# EAGLE design as3320-Bandpass (EAGLE 9.6.2)

## Sheet 1 of 6
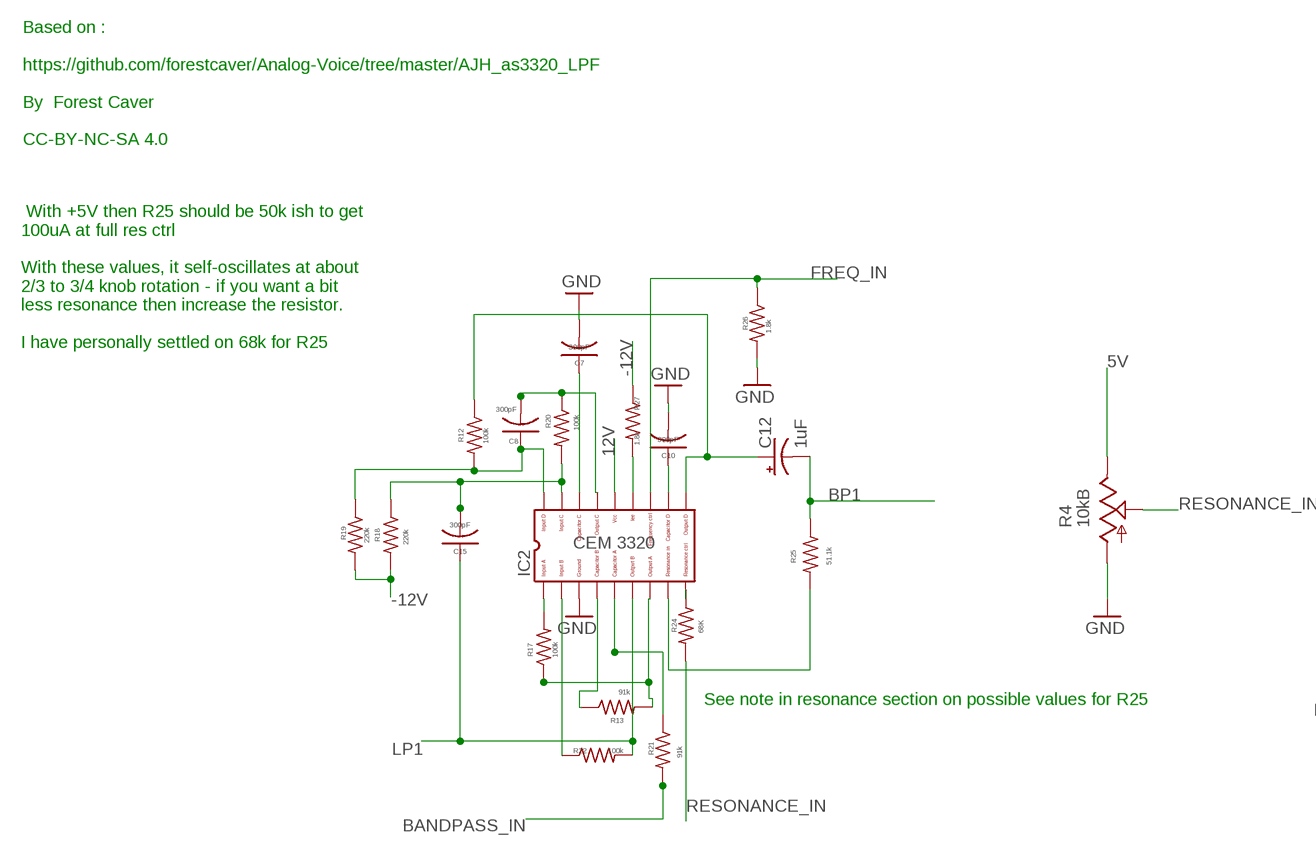
[diagram p0: schematic, sheet 1, part 1 of 2]
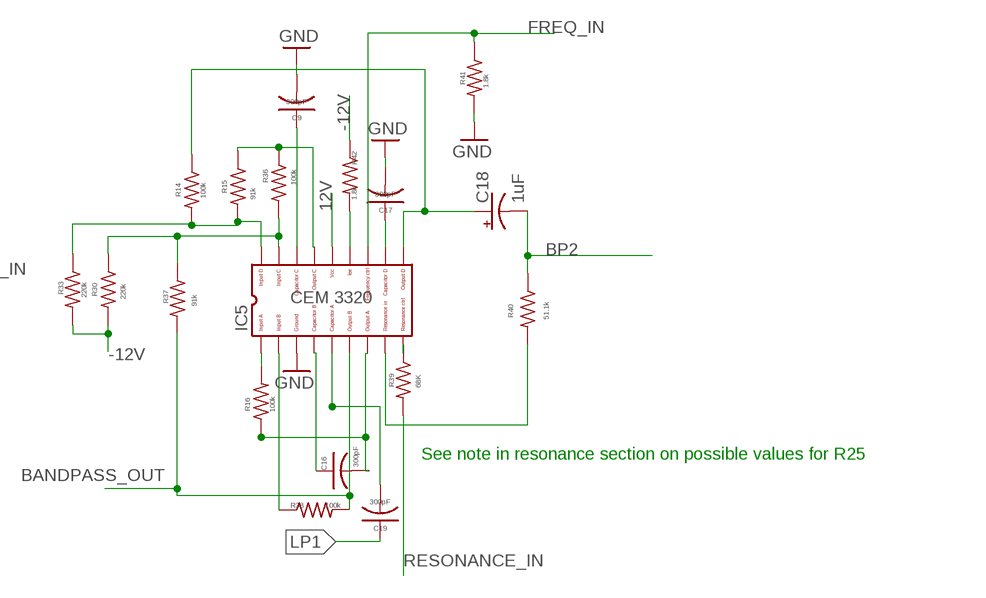
[diagram p1: schematic, sheet 1, part 2 of 2]

### Parts
C7  300pF  C-USC0603  [C0603]
C8  300pF  C-USC0603  [C0603]
C9  300pF  C-USC0603  [C0603]
C10  300pF  C-USC0603  [C0603]
C12  1uF  CPOL-USB  [PANASONIC_B]
C15  300pF  C-USC0603  [C0603]
C16  300pF  C-USC0603  [C0603]
C17  300pF  C-USC0603  [C0603]
C18  1uF  CPOL-USB  [PANASONIC_B]
C19  300pF  C-USC0603  [C0603]
IC2  CEM3320  [DIL18]
IC5  CEM3320  [DIL18]
R4  10kB  POT_USVERTICAL  [ALPS_POT_VERTICAL]
R12  100k  R-US_R0603  [R0603]
R13  91k  R-US_R0603  [R0603]
R14  100k  R-US_R0603  [R0603]
R15  91k  R-US_R0603  [R0603]
R16  100k  R-US_R0603  [R0603]
R17  100k  R-US_R0603  [R0603]
R18  220k  R-US_R0603  [R0603]
R19  220k  R-US_R0603  [R0603]
R20  100k  R-US_R0603  [R0603]
R21  91k  R-US_R0603  [R0603]
R22  100k  R-US_R0603  [R0603]
R24  68K  R-US_R0603  [R0603]
R25  51.1k  R-US_R0603  [R0603]
R26  1.8k  R-US_R0603  [R0603]
R27  1.8k  R-US_R0603  [R0603]
R30  220k  R-US_R0603  [R0603]
R33  220k  R-US_R0603  [R0603]
R36  100k  R-US_R0603  [R0603]
R37  91k  R-US_R0603  [R0603]
R38  100k  R-US_R0603  [R0603]
R39  68K  R-US_R0603  [R0603]
R40  51.1k  R-US_R0603  [R0603]
R41  1.8k  R-US_R0603  [R0603]
R42  1.8k  R-US_R0603  [R0603]

### Nets
5V [power]: R4.P$1(E) ; also sheet 4
12V [power]: IC2.14 IC5.14 ; also sheet 2,3,6
-12V [power]: R18.2 R19.2 R27.1 R30.2 R33.2 R42.1 ; also sheet 2,3,6
BANDPASS_IN: R21.2 ; also sheet 3
BANDPASS_OUT: IC5.6 R37.2 R38.2 ; also sheet 6
BP1: C12.- R25.1
BP2: C18.- R40.1
FREQ_IN: IC2.12 IC5.12 R26.1 R41.1 ; also sheet 3
GND [power]: C7.2 C9.2 C10.2 C17.2 IC2.3 IC5.3 R4.P$3(A) R26.2 R41.2 ; also sheet 2,3,4,6
LP1: C15.1 C19.1 IC2.6 R22.2
N$2 [nearfilter]: C10.1 IC2.11
N$14 [nearfilter]: IC2.9 R24.1
N$16 [nearfilter]: IC2.8 R25.2
N$17 [nearfilter]: IC2.13 R27.2
N$18 [nearfilter]: C17.1 IC5.11
N$19: C7.1 IC2.16
N$21 [nearfilter]: IC5.9 R39.1
N$23 [nearfilter]: C12.+ IC2.10 R12.1
N$24: IC2.5 R21.1
N$25: IC2.7 R13.2 R17.1
N$26: IC2.4 R13.1
N$27: IC2.2 R22.1
N$28 [nearfilter]: IC5.8 R40.2
N$29 [nearfilter]: IC5.13 R42.2
N$30: C9.1 IC5.16
N$31 [nearfilter]: C18.+ IC5.10 R14.1
N$32: C19.2 IC5.5
N$33: C16.2 IC5.7 R16.1
N$34: C16.1 IC5.4
N$35: IC5.2 R38.1
N$37: IC5.1 R16.2
N$38: IC5.17 R30.1 R36.2 R37.1
N$41: IC5.15 R15.1 R36.1
N$42: IC5.18 R14.2 R15.2 R33.1
N$43: IC2.1 R17.2
N$44: C15.2 IC2.17 R18.1 R20.2
N$49: C8.2 IC2.15 R20.1
N$50: C8.1 IC2.18 R12.2 R19.1
RESONANCE_IN: R4.P$2(S) R24.2 R39.2

### Notes on the sheet
- Based on :
  
  https://github.com/forestcaver/Analog-Voice/tree/master/AJH_as3320_LPF
  
  By  Forest Caver
  
  CC-BY-NC-SA 4.0
- With +5V then R25 should be 50k ish to get
  100uA at full res ctrl
  
  With these values, it self-oscillates at about
  2/3 to 3/4 knob rotation - if you want a bit
  less resonance then increase the resistor.
  
  I have personally settled on 68k for R25
- See note in resonance section on possible values for R25
- See note in resonance section on possible values for R25

## Sheet 2 of 6
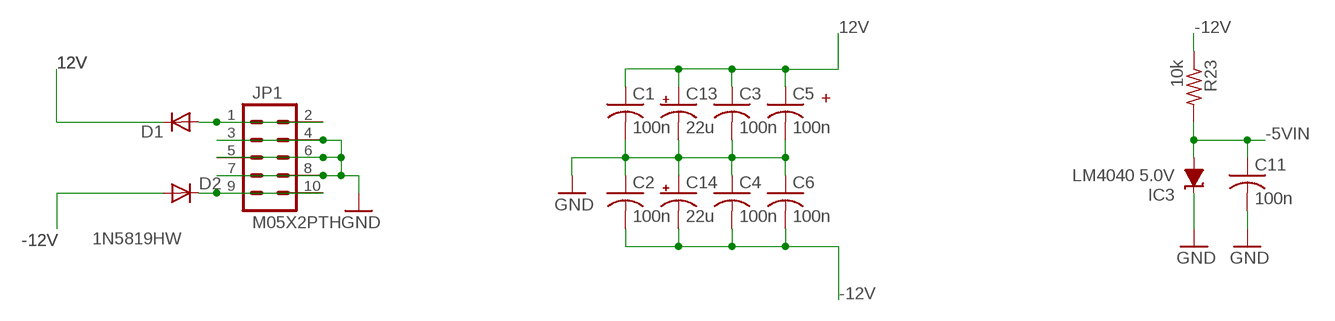
[diagram p2: schematic, sheet 2]

### Parts
C1  100n  C-USC0603  [C0603]
C2  100n  C-USC0603  [C0603]
C3  100n  C-USC0603  [C0603]
C4  100n  C-USC0603  [C0603]
C5  100n  C-USC0603  [C0603]
C6  100n  C-USC0603  [C0603]
C11  100n  C-USC0603  [C0603]
C13  22u  CPOL-USB  [PANASONIC_B]
C14  22u  CPOL-USB  [PANASONIC_B]
D1  1N5819HW  DIODE-SOD123  [SOD123]
D2  1N5819HW  DIODE-SOD123  [SOD123]
IC3  LM4040 5.0V  LM4041C12DBZ  [DBZ_R-PDSO-G3]
JP1  M05X2PTH  [AVR_ICSP]
R23  10k  R-US_R0603  [R0603]

### Nets
12V [power]: C1.1 C3.1 C5.1 C13.+ D1.C ; also sheet 1,3,6
-5VIN [power]: C11.1 IC3.2(A) R23.2 ; also sheet 4
-12V [power]: C2.2 C4.2 C6.2 C14.- D2.A R23.1 ; also sheet 1,3,6
GND [power]: C1.2 C2.1 C3.2 C4.1 C5.2 C6.1 C11.2 C13.- C14.+ IC3.1(C) JP1.3 JP1.4 JP1.5 JP1.6 JP1.7 JP1.8 ; also sheet 1,3,4,6
N$6: D1.A JP1.1 JP1.2
N$20: D2.C JP1.9 JP1.10

### Notes on the sheet
- +

## Sheet 3 of 6
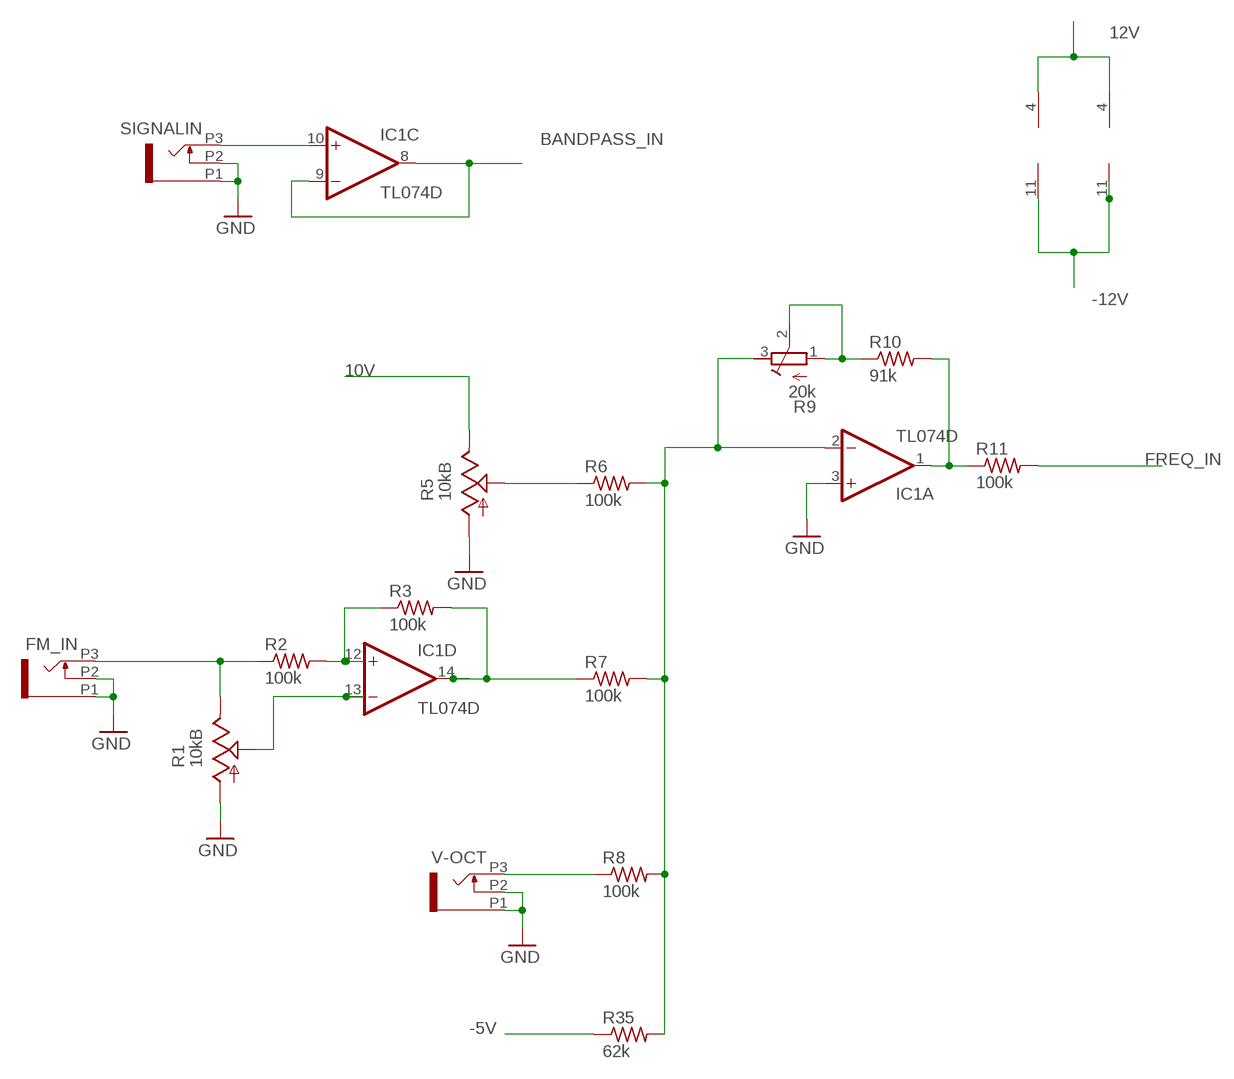
[diagram p3: schematic, sheet 3]

### Parts
FM_IN  PJ301_THONKICONN6  [WQP_PJ_301M6]
IC1  TL074D  [SO14]
IC4  TL074D  [SO14]
R1  10kB  POT_USVERTICAL  [ALPS_POT_VERTICAL]
R2  100k  R-US_R0603  [R0603]
R3  100k  R-US_R0603  [R0603]
R5  10kB  POT_USVERTICAL  [ALPS_POT_VERTICAL]
R6  100k  R-US_R0603  [R0603]
R7  100k  R-US_R0603  [R0603]
R8  100k  R-US_R0603  [R0603]
R9  20k  R-TRIMM3296X  [RTRIM3296X]
R10  91k  R-US_R0603  [R0603]
R11  100k  R-US_R0603  [R0603]
R35  62k  R-US_R0603  [R0603]
SIGNALIN  PJ301_THONKICONN6  [WQP_PJ_301M6]
V-OCT  PJ301_THONKICONN6  [WQP_PJ_301M6]

### Nets
10V [power]: R5.P$1(E) ; also sheet 4
12V [power]: IC1.4(P:V+) IC4.4(P:V+) ; also sheet 1,2,6
-5V [power]: R35.1 ; also sheet 4
-12V [power]: IC1.11(P:V-) IC4.11(P:V-) ; also sheet 1,2,6
BANDPASS_IN: IC1.8(C:OUT) IC1.9(C:-IN) ; also sheet 1
FREQ_IN: R11.2 ; also sheet 1
GND [power]: FM_IN.P1 FM_IN.P2 IC1.3(A:+IN) R1.P$3(A) R5.P$3(A) SIGNALIN.P1 SIGNALIN.P2 V-OCT.P1 V-OCT.P2 ; also sheet 1,2,4,6
N$3: IC1.13(D:-IN) R1.P$2(S)
N$4: R5.P$2(S) R6.1
N$5: IC1.12(D:+IN) R2.2 R3.1
N$7: IC1.2(A:-IN) R6.2 R7.2 R8.2 R9.3(A) R35.2
N$8: IC1.1(A:OUT) R10.2 R11.1
N$9: IC1.10(C:+IN) SIGNALIN.P3
N$10: R8.1 V-OCT.P3
N$12: IC1.14(D:OUT) R3.2 R7.1
N$55: R9.1(E) R9.2(S) R10.1
N$82: FM_IN.P3 R1.P$1(E) R2.1
Unconnected: IC1.5(B:+IN) IC1.6(B:-IN) IC1.7(B:OUT) IC4.12(D:+IN) IC4.13(D:-IN) IC4.14(D:OUT)

## Sheet 4 of 6: Ref
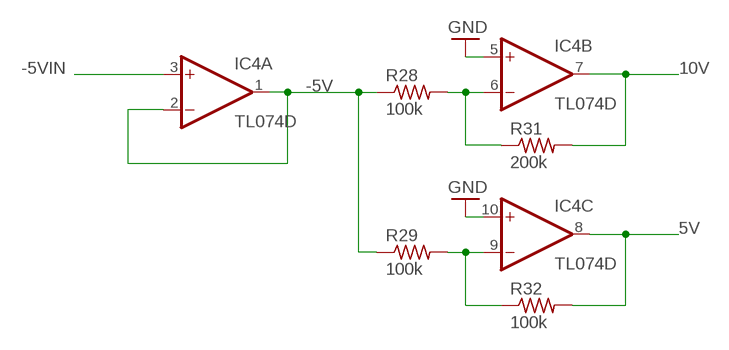
[diagram p4: schematic, sheet 4]

### Parts
R28  100k  R-US_R0603  [R0603]
R29  100k  R-US_R0603  [R0603]
R31  200k  R-US_R0603  [R0603]
R32  100k  R-US_R0603  [R0603]

### Nets
5V [power]: IC4.8(C:OUT) R32.2 ; also sheet 1
10V [power]: IC4.7(B:OUT) R31.2 ; also sheet 3
-5V [power]: IC4.1(A:OUT) IC4.2(A:-IN) R28.1 R29.1 ; also sheet 3
-5VIN [power]: IC4.3(A:+IN) ; also sheet 2
GND [power]: IC4.5(B:+IN) IC4.10(C:+IN) ; also sheet 1,2,3,6
N$13: IC4.9(C:-IN) R29.2 R32.1
N$15: IC4.6(B:-IN) R28.2 R31.1

## Sheet 5 of 6: Summing

## Sheet 6 of 6: Outputs
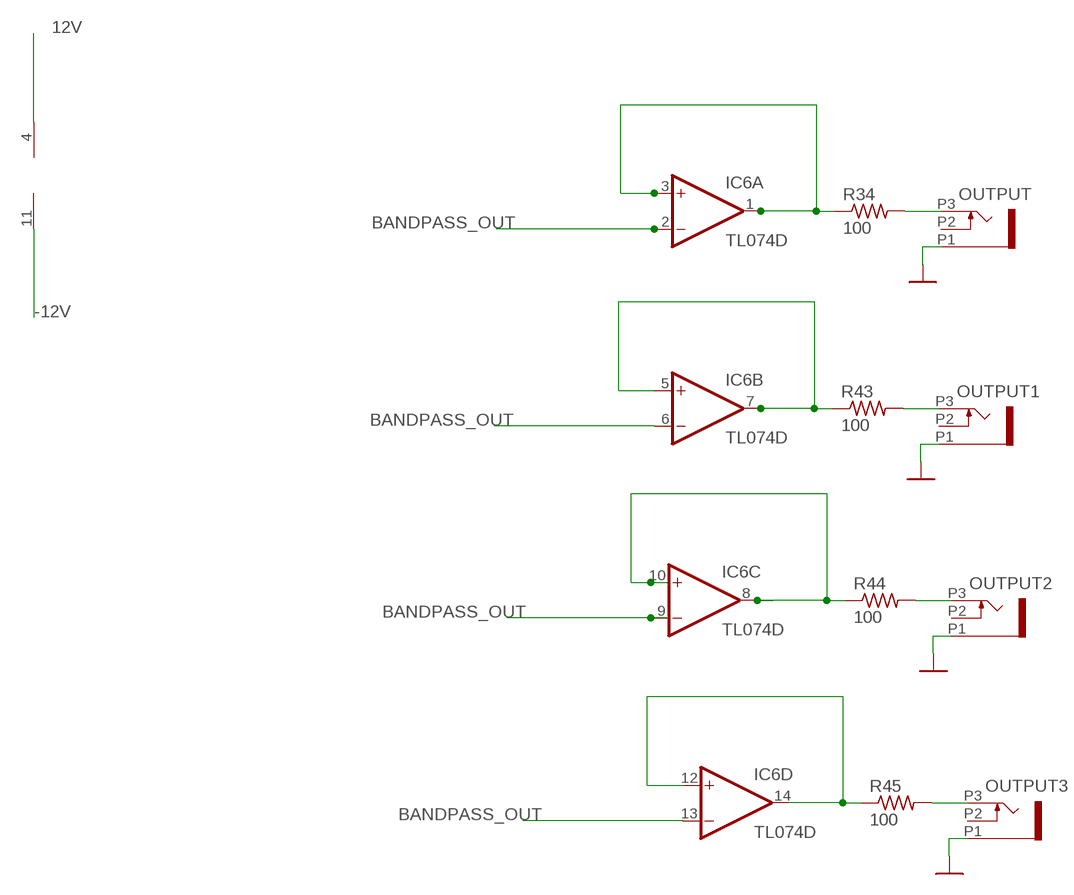
[diagram p5: schematic, sheet 6]

### Parts
IC6  TL074D  [SO14]
OUTPUT  PJ301_THONKICONN6  [WQP_PJ_301M6]
OUTPUT1  PJ301_THONKICONN6  [WQP_PJ_301M6]
OUTPUT2  PJ301_THONKICONN6  [WQP_PJ_301M6]
OUTPUT3  PJ301_THONKICONN6  [WQP_PJ_301M6]
R34  100  R-US_R0603  [R0603]
R43  100  R-US_R0603  [R0603]
R44  100  R-US_R0603  [R0603]
R45  100  R-US_R0603  [R0603]

### Nets
12V [power]: IC6.4(P:V+) ; also sheet 1,2,3
-12V [power]: IC6.11(P:V-) ; also sheet 1,2,3
BANDPASS_OUT: IC6.2(A:-IN) IC6.6(B:-IN) IC6.9(C:-IN) IC6.13(D:-IN) ; also sheet 1
GND [power]: OUTPUT1.P1 OUTPUT2.P1 OUTPUT3.P1 OUTPUT.P1 ; also sheet 1,2,3,4
N$1: IC6.1(A:OUT) IC6.3(A:+IN) R34.1
N$11: OUTPUT.P3 R34.2
N$36: IC6.5(B:+IN) IC6.7(B:OUT) R43.1
N$40: OUTPUT1.P3 R43.2
N$45: IC6.8(C:OUT) IC6.10(C:+IN) R44.1
N$46: OUTPUT2.P3 R44.2
N$47: IC6.12(D:+IN) IC6.14(D:OUT) R45.1
N$48: OUTPUT3.P3 R45.2
Unconnected: OUTPUT1.P2 OUTPUT2.P2 OUTPUT3.P2 OUTPUT.P2

## Library data of the parts
C1-C6 C11 = rcl:C-US: CAPACITOR, American symbol
C7-C10 C15-C17 C19 = rcl:C-US: CAPACITOR, American symbol; SPICEPREFIX: C
C12 C18 = rcl:CPOL-US: POLARIZED CAPACITOR, American symbol; SPICEPREFIX: C
C13 C14 = rcl:CPOL-US: POLARIZED CAPACITOR, American symbol
D1 D2 = diode:DIODE-: DIODE
FM_IN OUTPUT OUTPUT1-OUTPUT3 SIGNALIN V-OCT = og-pj301_variations:PJ301_THONKICONN
IC1 IC4 IC6 = linear:TL074: OP AMP
IC2 IC5 = CEM:CEM3320: CEM 3330 VCF
IC3 = texas:LM4041: PRECISION MICROPOWER SHUNT VOLTAGE REFERENCE Source: http://focus.ti.com/lit/ds/slcs146e/slcs146e.pdf
JP1 = og-header:M05X2: Header 5x2 Standard 10-pin dual row 0.1" header. Commonly used with AVR-ISP. Use with Spark Fun Electronics SKU: PRT-00778
R1 R4 R5 = og-pots:POT_US
R2 R3 R6-R8 R10 R11 R23 R28 R29 R31 R32 R34 R35 R43-R45 = resistor:R-US_: RESISTOR, American symbol
R9 = rcl:R-TRIMM: Trimm resistor
R12-R22 R24-R27 R30 R33 R36-R42 = rcl:R-US_: RESISTOR, American symbol; SPICEPREFIX: R

## Net classes
0 default: width 0.152 mm
1 power: width 0.406 mm
2 nearfilter: width 0.152 mm

## Board
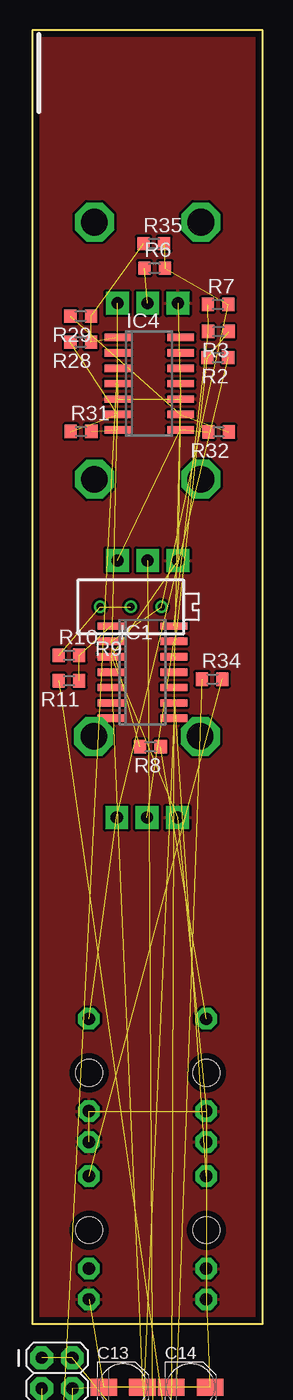
[diagram p6: board, top side]
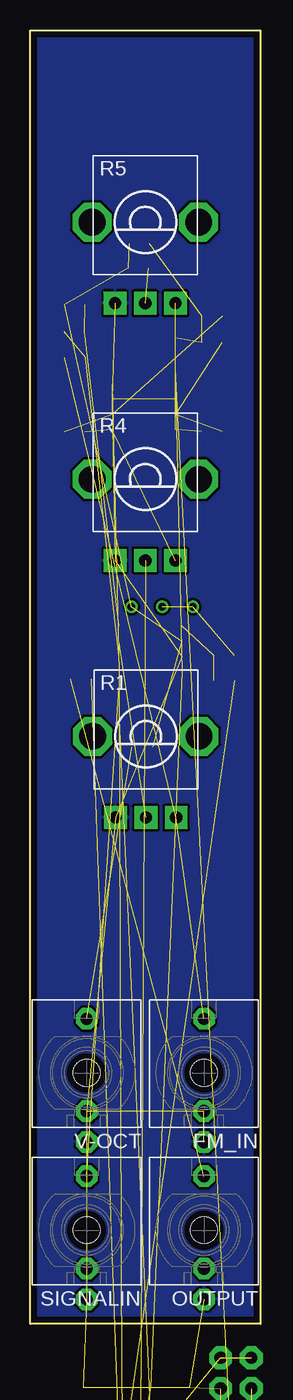
[diagram p7: board, bottom side, seen from below]

Size 19.03 x 106.76 mm. Coordinates in mm from the lower left corner, seen from the top.
Outline: 0,0 19.03,0 19.03,106.76 0,106.76 0,0
Copper layers (1*16): Top 0.035mm / dielectric 1.5mm / Bottom 0.035mm
Design rules "Mutable_PCBCart-Standard": minimum track width 8mil, minimum drill 0.4mm, track to track 8mil, track to pad 8mil, pad to pad 8mil, via to via 8mil, smd to smd 8mil, copper to edge 20mil, drill to drill 8mil, minimum pad ring 8mil, minimum via ring 10mil, stop-mask expansion 3mil, vias tented up to drill 25mil, thermal gap 8mil

### Footprints (pad centres in the part's own frame; a part is rotated, then mirrored left to right if it is on the bottom)
C0603 = smd 1.1 x 1: 1 -0.85,0; 2 0.85,0
PANASONIC_B = smd 2.2 x 1.4: + 1.6,0; - -1.6,0
SOD123 = smd 1.4 x 1.4: A 1.9,0; C -1.9,0
WQP_PJ_301M6 = drill 1.016 pad 1.778 octagon: P1 0,-5.715; P2 0,-3.175; P3 0,4.445 | hole 2.2: 0,0
SO14 = smd 0.6 x 2.2: 1 -3.81,-2.6; 2 -2.54,-2.6; 3 -1.27,-2.6; 4 0,-2.6; 5 1.27,-2.6; 6 2.54,-2.6; 7 3.81,-2.6; 8 3.81,2.6; 9 2.54,2.6; 10 1.27,2.6; 11 0,2.6; 12 -1.27,2.6; 13 -2.54,2.6; 14 -3.81,2.6
DIL18 = drill 0.813 long: 1 -10.16,-3.81; 2 -7.62,-3.81; 3 -5.08,-3.81; 4 -2.54,-3.81; 5 0,-3.81; 6 2.54,-3.81; 7 5.08,-3.81; 8 7.62,-3.81; 9 10.16,-3.81; 10 10.16,3.81; 11 7.62,3.81; 12 5.08,3.81; 13 2.54,3.81; 14 0,3.81; 15 -2.54,3.81; 16 -5.08,3.81; 17 -7.62,3.81; 18 -10.16,3.81
DBZ_R-PDSO-G3 = smd 0.7 x 1: 1 -0.95,-1.1; 2 0.95,-1.1; 3 0,1.1
AVR_ICSP = drill 1.016 pad 1.88 octagon: 1 -1.27,5.08; 2 1.27,5.08; 3 -1.27,2.54; 4 1.27,2.54; 5 -1.27,0; 6 1.27,0; 7 -1.27,-2.54; 8 1.27,-2.54; 9 -1.27,-5.08; 10 1.27,-5.08
ALPS_POT_VERTICAL = drill 1 pad 1.88 square: P$1 -2.5,6.7; P$2 0,6.7; P$3 2.5,6.7 | drill 2.2 pad 3.175 octagon: P$4 -4.4,0; P$5 4.4,0
R0603 = smd 1 x 1.1: 1 -0.85,0; 2 0.85,0
RTRIM3296X = drill 0.61: 1 0,-2.54; 2 0,0; 3 0,2.54

### Placement (x,y rotation side)
C1  16,-24.26 0 top  (outside the outline)
C2  0.13,-29.97 0 top  (outside the outline)
C3  5.59,-29.97 0 top  (outside the outline)
C4  11.05,-29.97 0 top  (outside the outline)
C5  16.51,-29.97 0 top  (outside the outline)
C6  0.13,-34.92 0 top  (outside the outline)
C7  5.71,-155.96 0 top  (outside the outline)
C8  0.13,-178.44 0 top  (outside the outline)
C9  5.71,-68.71 0 top  (outside the outline)
C10  18.67,-155.96 0 top  (outside the outline)
C11  5.59,-34.92 0 top  (outside the outline)
C12  1.4,-157.23 0 top  (outside the outline)
C13  7.49,-5.21 0 top  (outside the outline)
C14  13.08,-5.21 0 top  (outside the outline)
C15  0.13,-193.29 0 top  (outside the outline)
C16  12.19,-68.71 0 top  (outside the outline)
C17  18.67,-68.71 0 top  (outside the outline)
C18  1.4,-69.98 0 top  (outside the outline)
C19  0.13,-76.33 0 top  (outside the outline)
D1  13.08,-17.14 0 top  (outside the outline)
D2  1.27,-24.64 0 top  (outside the outline)
FM_IN  4.67,20.74 0 bottom
IC1  9.09,53.79 270 top
IC2  12.95,-148.21 0 top  (outside the outline)
IC3  1.02,-18.03 0 top  (outside the outline)
IC4  9.65,77.6 270 top
IC5  12.95,-60.96 0 top  (outside the outline)
IC6  4.95,-228.35 0 top  (outside the outline)
JP1  2.03,-7.87 0 top
OUTPUT  4.67,7.75 0 bottom
OUTPUT1  3.17,-201.8 0 top  (outside the outline)
OUTPUT2  3.17,-238.25 0 top  (outside the outline)
OUTPUT3  3.17,-265.43 0 top  (outside the outline)
R1  9.47,48.49 180 bottom
R2  15.32,79.75 180 top
R3  15.38,81.9 180 top
R4  9.53,69.71 180 bottom
R5  9.53,90.93 180 bottom
R6  10.11,87.13 0 top
R7  15.35,84.13 0 top
R8  9.75,47.63 180 top
R9  8.13,59.18 270 top
R10  3.02,55.17 0 top
R11  3.02,53.09 180 top
R12  12.45,-163.58 0 top  (outside the outline)
R13  0.13,-183.39 0 top  (outside the outline)
R14  12.45,-76.33 0 top  (outside the outline)
R15  0.13,-86.23 0 top  (outside the outline)
R16  17.78,-76.33 0 top  (outside the outline)
R17  17.78,-163.58 0 top  (outside the outline)
R18  0.13,-168.53 0 top  (outside the outline)
R19  5.46,-168.53 0 top  (outside the outline)
R20  10.79,-168.53 0 top  (outside the outline)
R21  0.13,-188.34 0 top  (outside the outline)
R22  16.13,-168.53 0 top  (outside the outline)
R23  11.56,-24.51 0 top  (outside the outline)
R24  14.35,-173.48 0 top  (outside the outline)
R25  6.6,-163.58 0 top  (outside the outline)
R26  21.46,-168.53 0 top  (outside the outline)
R27  0.13,-173.48 0 top  (outside the outline)
R28  3.98,81.03 180 top
R29  3.98,83.17 180 top
R30  23.11,-76.33 0 top  (outside the outline)
R31  4.02,73.65 0 top
R32  15.39,73.61 180 top
R33  0.13,-81.28 0 top  (outside the outline)
R34  14.86,53.21 0 top
R35  10.03,89.15 0 top
R36  5.46,-81.28 0 top  (outside the outline)
R37  4.83,-86.23 0 top  (outside the outline)
R38  10.79,-81.28 0 top  (outside the outline)
R39  9.53,-86.23 0 top  (outside the outline)
R40  6.6,-76.33 0 top  (outside the outline)
R41  16.13,-81.28 0 top  (outside the outline)
R42  20.95,-81.28 0 top  (outside the outline)
R43  0.13,-220.34 0 top  (outside the outline)
R44  0.13,-256.79 0 top  (outside the outline)
R45  0.13,-283.97 0 top  (outside the outline)
SIGNALIN  14.37,7.75 0 bottom
V-OCT  14.37,20.74 0 bottom

### Tracks (layer width: path | path; a pad name or v marks a point on that pad's centre or on a via)
5V  (2 unrouted)
10V  (2 unrouted)
12V  (9 unrouted)
-5V  (4 unrouted)
-5VIN  (3 unrouted)
-12V  (14 unrouted)
BANDPASS_IN  (2 unrouted)
BANDPASS_OUT  (6 unrouted)
BP1  (1 unrouted)
BP2  (1 unrouted)
FREQ_IN  (4 unrouted)
GND  (39 unrouted)
  pour Top: -0.89,107.7 19.43,107.7 20.07,107.06 20.32,106.81 20.32,-0.25 19.3,-1.27 -0.25,-1.27 -0.89,-0.64
  pour Bottom: -1.4,108.33 20.07,108.33 20.07,-0.64 -1.14,-0.64 -1.4,-0.38
LP1  (3 unrouted)
N$1  (2 unrouted)
N$2  (1 unrouted)
N$3  (1 unrouted)
N$4  (1 unrouted)
N$5  (2 unrouted)
N$6  (2 unrouted)
N$7  (5 unrouted)
N$8  (2 unrouted)
N$9  (1 unrouted)
N$10  (1 unrouted)
N$11  (1 unrouted)
N$12  (2 unrouted)
N$13  (2 unrouted)
N$14  (1 unrouted)
N$15  (2 unrouted)
N$16  (1 unrouted)
N$17  (1 unrouted)
N$18  (1 unrouted)
N$19  (1 unrouted)
N$20  (2 unrouted)
N$21  (1 unrouted)
N$23  (2 unrouted)
N$24  (1 unrouted)
N$25  (2 unrouted)
N$26  (1 unrouted)
N$27  (1 unrouted)
N$28  (1 unrouted)
N$29  (1 unrouted)
N$30  (1 unrouted)
N$31  (2 unrouted)
N$32  (1 unrouted)
N$33  (2 unrouted)
N$34  (1 unrouted)
N$35  (1 unrouted)
N$36  (2 unrouted)
N$37  (1 unrouted)
N$38  (3 unrouted)
N$40  (1 unrouted)
N$41  (2 unrouted)
N$42  (3 unrouted)
N$43  (1 unrouted)
N$44  (3 unrouted)
N$45  (2 unrouted)
N$46  (1 unrouted)
N$47  (2 unrouted)
N$48  (1 unrouted)
N$49  (2 unrouted)
N$50  (3 unrouted)
N$55  (2 unrouted)
N$82  (2 unrouted)
RESONANCE_IN  (2 unrouted)